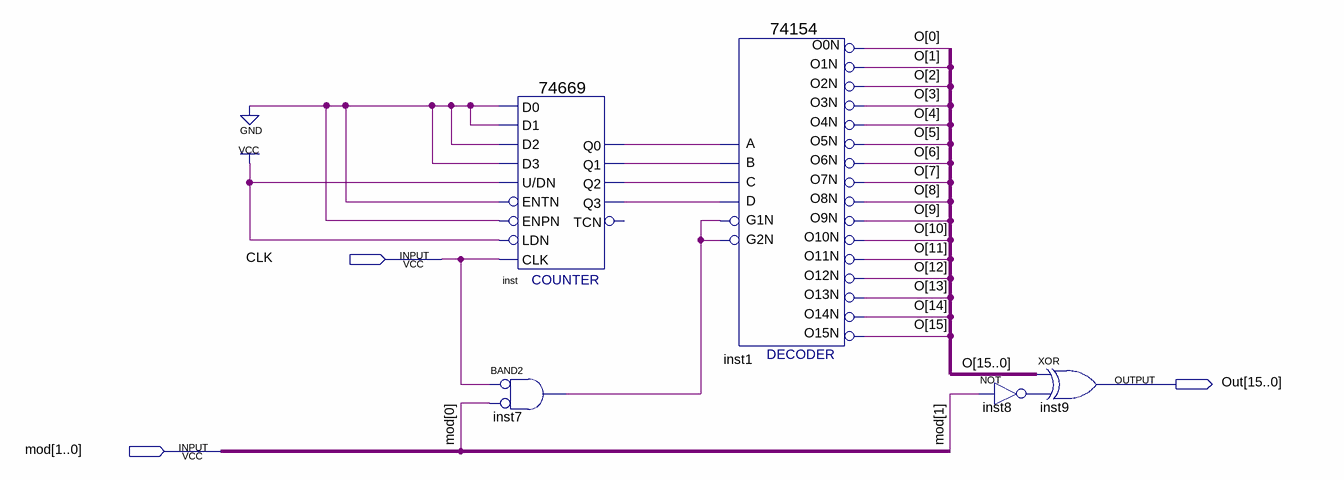
[diagram p0: schematic sheet]
// Quartus schematic Block3.bdf as structural Verilog: 5 symbols, 3 pins
module Block3 (
  input  CLK,
  input  [1:0] mod,
  output [15:0] Out
);

  wire inst7_out, inst8_out, inst_q0, inst_q1, inst_q2, inst_q3;
  wire [15:0] O;

  \74669  inst (
    .D1(1'b0), .D3(1'b0), .D2(1'b0), .\U/DN (1'b1), .ENTN(1'b0), .LDN(1'b1), .CLK(CLK), .ENPN(1'b0),
    .D0(1'b0), .Q2(inst_q2), .Q3(inst_q3), .Q1(inst_q1), .Q0(inst_q0));  // open: TCN
  and inst7 (inst7_out, ~CLK, ~mod[0]);  // BAND2
  \74154  inst1 (
    .C(inst_q2), .D(inst_q3), .B(inst_q1), .A(inst_q0), .G1N(inst7_out), .G2N(inst7_out), .O0N(O[0]),
    .O12N(O[12]), .O15N(O[15]), .O10N(O[10]), .O11N(O[11]), .O1N(O[1]), .O13N(O[13]), .O14N(O[14]),
    .O4N(O[4]), .O3N(O[3]), .O2N(O[2]), .O7N(O[7]), .O6N(O[6]), .O5N(O[5]), .O9N(O[9]), .O8N(O[8]));
  assign Out = O ^ {16{inst8_out}};  // XOR inst9, 16 bits wide
  not inst8 (inst8_out, mod[1]);
endmodule
